# Altium schematic sheet switch matrix.SchDoc
size 584 x 241 mm; SheetNumber: 2; SheetTotal: 2
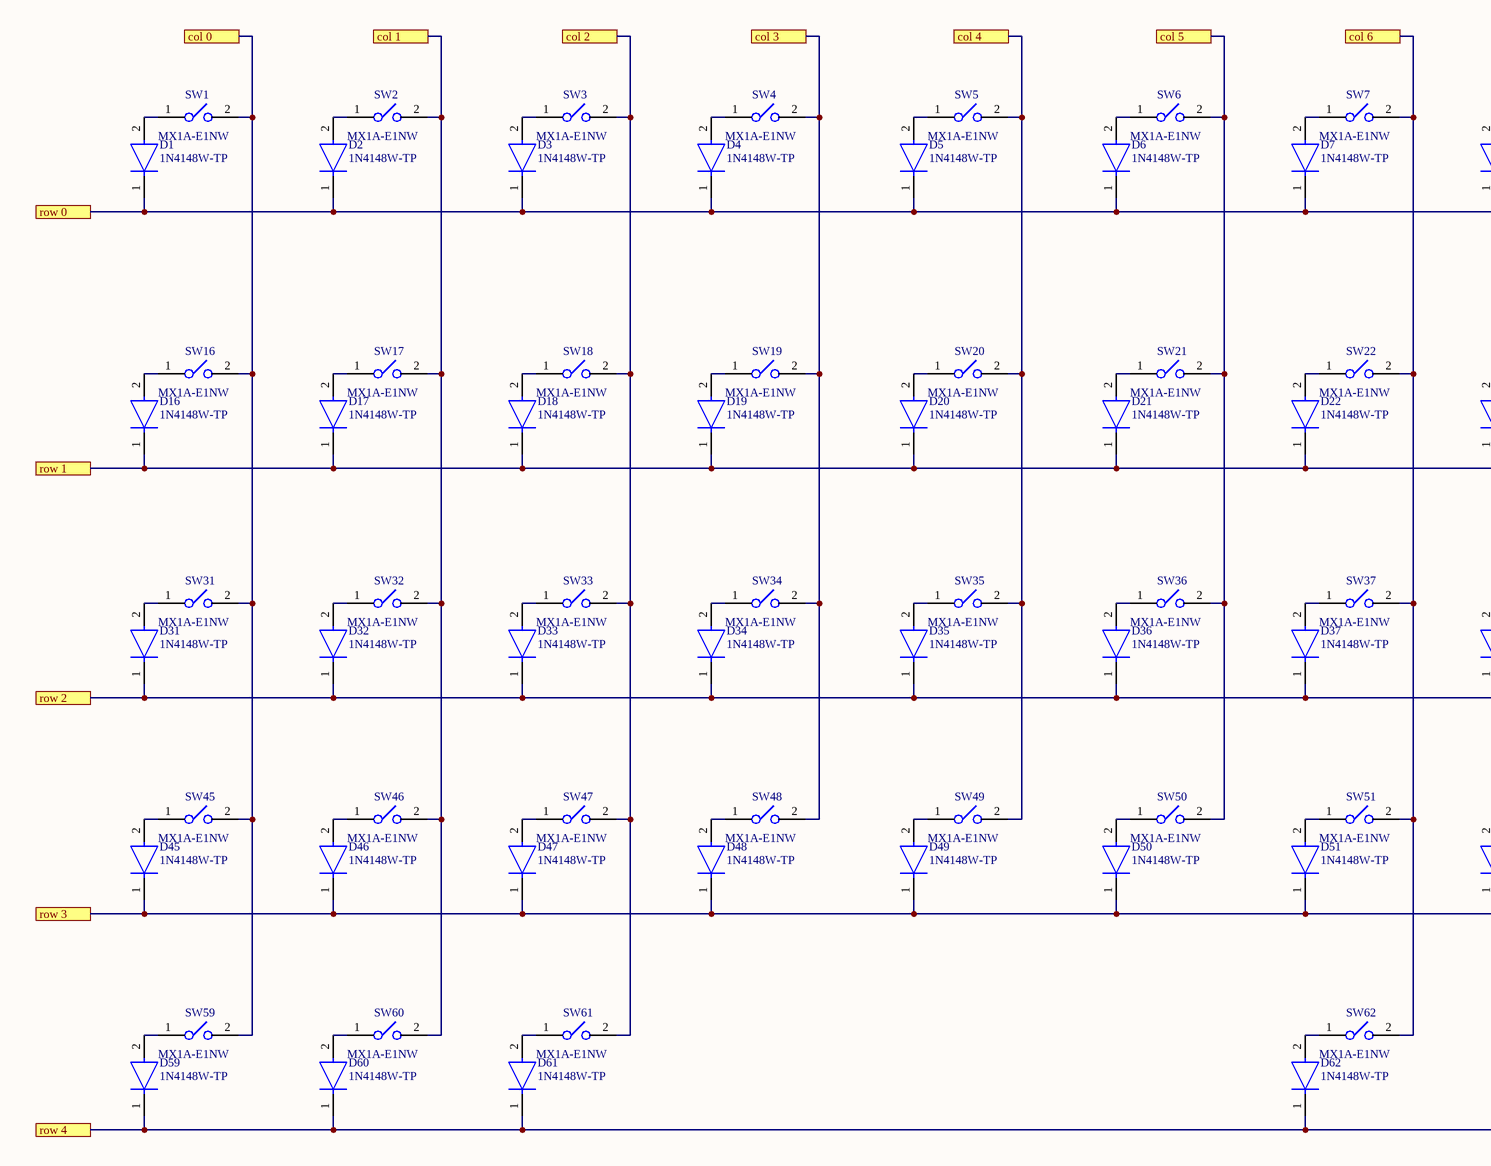
[diagram p0: switch matrix.SchDoc, left]
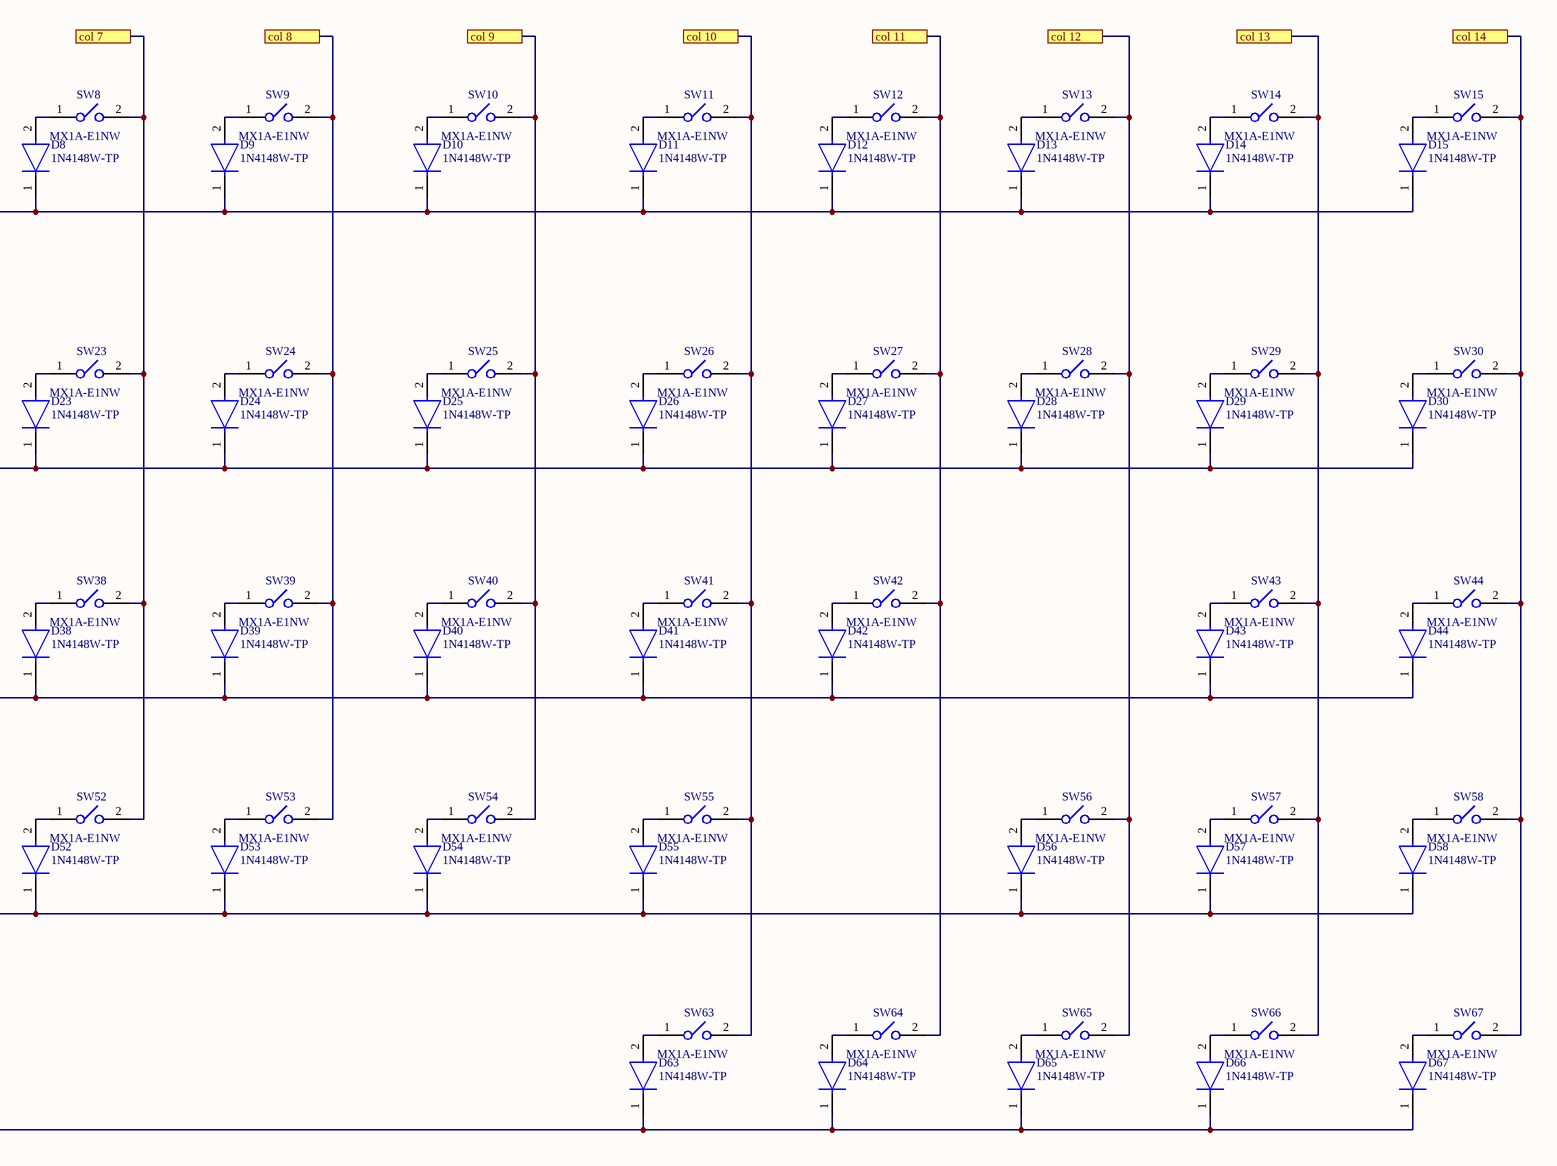
[diagram p1: switch matrix.SchDoc, right]

## Parts
D1  1N4148W-TP  [FP-SOD-123-IPC_A]
D2  1N4148W-TP  [FP-SOD-123-IPC_A]
D3  1N4148W-TP  [FP-SOD-123-IPC_A]
D4  1N4148W-TP  [FP-SOD-123-IPC_A]
D5  1N4148W-TP  [FP-SOD-123-IPC_A]
D6  1N4148W-TP  [FP-SOD-123-IPC_A]
D7  1N4148W-TP  [FP-SOD-123-IPC_A]
D8  1N4148W-TP  [FP-SOD-123-IPC_A]
D9  1N4148W-TP  [FP-SOD-123-IPC_A]
D10  1N4148W-TP  [FP-SOD-123-IPC_A]
D11  1N4148W-TP  [FP-SOD-123-IPC_A]
D12  1N4148W-TP  [FP-SOD-123-IPC_A]
D13  1N4148W-TP  [FP-SOD-123-IPC_A]
D14  1N4148W-TP  [FP-SOD-123-IPC_A]
D15  1N4148W-TP  [FP-SOD-123-IPC_A]
D16  1N4148W-TP  [FP-SOD-123-IPC_A]
D17  1N4148W-TP  [FP-SOD-123-IPC_A]
D18  1N4148W-TP  [FP-SOD-123-IPC_A]
D19  1N4148W-TP  [FP-SOD-123-IPC_A]
D20  1N4148W-TP  [FP-SOD-123-IPC_A]
D21  1N4148W-TP  [FP-SOD-123-IPC_A]
D22  1N4148W-TP  [FP-SOD-123-IPC_A]
D23  1N4148W-TP  [FP-SOD-123-IPC_A]
D24  1N4148W-TP  [FP-SOD-123-IPC_A]
D25  1N4148W-TP  [FP-SOD-123-IPC_A]
D26  1N4148W-TP  [FP-SOD-123-IPC_A]
D27  1N4148W-TP  [FP-SOD-123-IPC_A]
D28  1N4148W-TP  [FP-SOD-123-IPC_A]
D29  1N4148W-TP  [FP-SOD-123-IPC_A]
D30  1N4148W-TP  [FP-SOD-123-IPC_A]
D31  1N4148W-TP  [FP-SOD-123-IPC_A]
D32  1N4148W-TP  [FP-SOD-123-IPC_A]
D33  1N4148W-TP  [FP-SOD-123-IPC_A]
D34  1N4148W-TP  [FP-SOD-123-IPC_A]
D35  1N4148W-TP  [FP-SOD-123-IPC_A]
D36  1N4148W-TP  [FP-SOD-123-IPC_A]
D37  1N4148W-TP  [FP-SOD-123-IPC_A]
D38  1N4148W-TP  [FP-SOD-123-IPC_A]
D39  1N4148W-TP  [FP-SOD-123-IPC_A]
D40  1N4148W-TP  [FP-SOD-123-IPC_A]
D41  1N4148W-TP  [FP-SOD-123-IPC_A]
D42  1N4148W-TP  [FP-SOD-123-IPC_A]
D43  1N4148W-TP  [FP-SOD-123-IPC_A]
D44  1N4148W-TP  [FP-SOD-123-IPC_A]
D45  1N4148W-TP  [FP-SOD-123-IPC_A]
D46  1N4148W-TP  [FP-SOD-123-IPC_A]
D47  1N4148W-TP  [FP-SOD-123-IPC_A]
D48  1N4148W-TP  [FP-SOD-123-IPC_A]
D49  1N4148W-TP  [FP-SOD-123-IPC_A]
D50  1N4148W-TP  [FP-SOD-123-IPC_A]
D51  1N4148W-TP  [FP-SOD-123-IPC_A]
D52  1N4148W-TP  [FP-SOD-123-IPC_A]
D53  1N4148W-TP  [FP-SOD-123-IPC_A]
D54  1N4148W-TP  [FP-SOD-123-IPC_A]
D55  1N4148W-TP  [FP-SOD-123-IPC_A]
D56  1N4148W-TP  [FP-SOD-123-IPC_A]
D57  1N4148W-TP  [FP-SOD-123-IPC_A]
D58  1N4148W-TP  [FP-SOD-123-IPC_A]
D59  1N4148W-TP  [FP-SOD-123-IPC_A]
D60  1N4148W-TP  [FP-SOD-123-IPC_A]
D61  1N4148W-TP  [FP-SOD-123-IPC_A]
D62  1N4148W-TP  [FP-SOD-123-IPC_A]
D63  1N4148W-TP  [FP-SOD-123-IPC_A]
D64  1N4148W-TP  [FP-SOD-123-IPC_A]
D65  1N4148W-TP  [FP-SOD-123-IPC_A]
D66  1N4148W-TP  [FP-SOD-123-IPC_A]
D67  1N4148W-TP  [FP-SOD-123-IPC_A]
SW1  Part Number: MX1A-E1NW  [SW_Cherry_MX_1.00u_PCB]  (hidden comment: Switch_Key_Switch_MX1A-E1NW_eec)
SW2  Part Number: MX1A-E1NW  [SW_Cherry_MX_1.00u_PCB]  (hidden comment: Switch_Key_Switch_MX1A-E1NW_eec)
SW3  Part Number: MX1A-E1NW  [SW_Cherry_MX_1.00u_PCB]  (hidden comment: Switch_Key_Switch_MX1A-E1NW_eec)
SW4  Part Number: MX1A-E1NW  [SW_Cherry_MX_1.00u_PCB]  (hidden comment: Switch_Key_Switch_MX1A-E1NW_eec)
SW5  Part Number: MX1A-E1NW  [SW_Cherry_MX_1.00u_PCB]  (hidden comment: Switch_Key_Switch_MX1A-E1NW_eec)
SW6  Part Number: MX1A-E1NW  [SW_Cherry_MX_1.00u_PCB]  (hidden comment: Switch_Key_Switch_MX1A-E1NW_eec)
SW7  Part Number: MX1A-E1NW  [SW_Cherry_MX_1.00u_PCB]  (hidden comment: Switch_Key_Switch_MX1A-E1NW_eec)
SW8  Part Number: MX1A-E1NW  [SW_Cherry_MX_1.00u_PCB]  (hidden comment: Switch_Key_Switch_MX1A-E1NW_eec)
SW9  Part Number: MX1A-E1NW  [SW_Cherry_MX_1.00u_PCB]  (hidden comment: Switch_Key_Switch_MX1A-E1NW_eec)
SW10  Part Number: MX1A-E1NW  [SW_Cherry_MX_1.00u_PCB]  (hidden comment: Switch_Key_Switch_MX1A-E1NW_eec)
SW11  Part Number: MX1A-E1NW  [SW_Cherry_MX_1.00u_PCB]  (hidden comment: Switch_Key_Switch_MX1A-E1NW_eec)
SW12  Part Number: MX1A-E1NW  [SW_Cherry_MX_1.00u_PCB]  (hidden comment: Switch_Key_Switch_MX1A-E1NW_eec)
SW13  Part Number: MX1A-E1NW  [SW_Cherry_MX_1.00u_PCB]  (hidden comment: Switch_Key_Switch_MX1A-E1NW_eec)
SW14  Part Number: MX1A-E1NW  [SW_Cherry_MX_2.00u_PCB]  (hidden comment: Switch_Key_Switch_MX1A-E1NW_eec)
SW15  Part Number: MX1A-E1NW  [SW_Cherry_MX_1.00u_PCB]  (hidden comment: Switch_Key_Switch_MX1A-E1NW_eec)
SW16  Part Number: MX1A-E1NW  [SW_Cherry_MX_1.50u_PCB]  (hidden comment: Switch_Key_Switch_MX1A-E1NW_eec)
SW17  Part Number: MX1A-E1NW  [SW_Cherry_MX_1.00u_PCB]  (hidden comment: Switch_Key_Switch_MX1A-E1NW_eec)
SW18  Part Number: MX1A-E1NW  [SW_Cherry_MX_1.00u_PCB]  (hidden comment: Switch_Key_Switch_MX1A-E1NW_eec)
SW19  Part Number: MX1A-E1NW  [SW_Cherry_MX_1.00u_PCB]  (hidden comment: Switch_Key_Switch_MX1A-E1NW_eec)
SW20  Part Number: MX1A-E1NW  [SW_Cherry_MX_1.00u_PCB]  (hidden comment: Switch_Key_Switch_MX1A-E1NW_eec)
SW21  Part Number: MX1A-E1NW  [SW_Cherry_MX_1.00u_PCB]  (hidden comment: Switch_Key_Switch_MX1A-E1NW_eec)
SW22  Part Number: MX1A-E1NW  [SW_Cherry_MX_1.00u_PCB]  (hidden comment: Switch_Key_Switch_MX1A-E1NW_eec)
SW23  Part Number: MX1A-E1NW  [SW_Cherry_MX_1.00u_PCB]  (hidden comment: Switch_Key_Switch_MX1A-E1NW_eec)
SW24  Part Number: MX1A-E1NW  [SW_Cherry_MX_1.00u_PCB]  (hidden comment: Switch_Key_Switch_MX1A-E1NW_eec)
SW25  Part Number: MX1A-E1NW  [SW_Cherry_MX_1.00u_PCB]  (hidden comment: Switch_Key_Switch_MX1A-E1NW_eec)
SW26  Part Number: MX1A-E1NW  [SW_Cherry_MX_1.00u_PCB]  (hidden comment: Switch_Key_Switch_MX1A-E1NW_eec)
SW27  Part Number: MX1A-E1NW  [SW_Cherry_MX_1.00u_PCB]  (hidden comment: Switch_Key_Switch_MX1A-E1NW_eec)
SW28  Part Number: MX1A-E1NW  [SW_Cherry_MX_1.00u_PCB]  (hidden comment: Switch_Key_Switch_MX1A-E1NW_eec)
SW29  Part Number: MX1A-E1NW  [SW_Cherry_MX_1.50u_PCB]  (hidden comment: Switch_Key_Switch_MX1A-E1NW_eec)
SW30  Part Number: MX1A-E1NW  [SW_Cherry_MX_1.00u_PCB]  (hidden comment: Switch_Key_Switch_MX1A-E1NW_eec)
SW31  Part Number: MX1A-E1NW  [SW_Cherry_MX_1.75u_PCB]  (hidden comment: Switch_Key_Switch_MX1A-E1NW_eec)
SW32  Part Number: MX1A-E1NW  [SW_Cherry_MX_1.00u_PCB]  (hidden comment: Switch_Key_Switch_MX1A-E1NW_eec)
SW33  Part Number: MX1A-E1NW  [SW_Cherry_MX_1.00u_PCB]  (hidden comment: Switch_Key_Switch_MX1A-E1NW_eec)
SW34  Part Number: MX1A-E1NW  [SW_Cherry_MX_1.00u_PCB]  (hidden comment: Switch_Key_Switch_MX1A-E1NW_eec)
SW35  Part Number: MX1A-E1NW  [SW_Cherry_MX_1.00u_PCB]  (hidden comment: Switch_Key_Switch_MX1A-E1NW_eec)
SW36  Part Number: MX1A-E1NW  [SW_Cherry_MX_1.00u_PCB]  (hidden comment: Switch_Key_Switch_MX1A-E1NW_eec)
SW37  Part Number: MX1A-E1NW  [SW_Cherry_MX_1.00u_PCB]  (hidden comment: Switch_Key_Switch_MX1A-E1NW_eec)
SW38  Part Number: MX1A-E1NW  [SW_Cherry_MX_1.00u_PCB]  (hidden comment: Switch_Key_Switch_MX1A-E1NW_eec)
SW39  Part Number: MX1A-E1NW  [SW_Cherry_MX_1.00u_PCB]  (hidden comment: Switch_Key_Switch_MX1A-E1NW_eec)
SW40  Part Number: MX1A-E1NW  [SW_Cherry_MX_1.00u_PCB]  (hidden comment: Switch_Key_Switch_MX1A-E1NW_eec)
SW41  Part Number: MX1A-E1NW  [SW_Cherry_MX_1.00u_PCB]  (hidden comment: Switch_Key_Switch_MX1A-E1NW_eec)
SW42  Part Number: MX1A-E1NW  [SW_Cherry_MX_1.00u_PCB]  (hidden comment: Switch_Key_Switch_MX1A-E1NW_eec)
SW43  Part Number: MX1A-E1NW  [SW_Cherry_MX_2.00u_PCB]  (hidden comment: Switch_Key_Switch_MX1A-E1NW_eec)
SW44  Part Number: MX1A-E1NW  [SW_Cherry_MX_1.00u_PCB]  (hidden comment: Switch_Key_Switch_MX1A-E1NW_eec)
SW45  Part Number: MX1A-E1NW  [SW_Cherry_MX_2.00u_PCB]  (hidden comment: Switch_Key_Switch_MX1A-E1NW_eec)
SW46  Part Number: MX1A-E1NW  [SW_Cherry_MX_1.00u_PCB]  (hidden comment: Switch_Key_Switch_MX1A-E1NW_eec)
SW47  Part Number: MX1A-E1NW  [SW_Cherry_MX_1.00u_PCB]  (hidden comment: Switch_Key_Switch_MX1A-E1NW_eec)
SW48  Part Number: MX1A-E1NW  [SW_Cherry_MX_1.00u_PCB]  (hidden comment: Switch_Key_Switch_MX1A-E1NW_eec)
SW49  Part Number: MX1A-E1NW  [SW_Cherry_MX_1.00u_PCB]  (hidden comment: Switch_Key_Switch_MX1A-E1NW_eec)
SW50  Part Number: MX1A-E1NW  [SW_Cherry_MX_1.00u_PCB]  (hidden comment: Switch_Key_Switch_MX1A-E1NW_eec)
SW51  Part Number: MX1A-E1NW  [SW_Cherry_MX_1.00u_PCB]  (hidden comment: Switch_Key_Switch_MX1A-E1NW_eec)
SW52  Part Number: MX1A-E1NW  [SW_Cherry_MX_1.00u_PCB]  (hidden comment: Switch_Key_Switch_MX1A-E1NW_eec)
SW53  Part Number: MX1A-E1NW  [SW_Cherry_MX_1.00u_PCB]  (hidden comment: Switch_Key_Switch_MX1A-E1NW_eec)
SW54  Part Number: MX1A-E1NW  [SW_Cherry_MX_1.00u_PCB]  (hidden comment: Switch_Key_Switch_MX1A-E1NW_eec)
SW55  Part Number: MX1A-E1NW  [SW_Cherry_MX_1.00u_PCB]  (hidden comment: Switch_Key_Switch_MX1A-E1NW_eec)
SW56  Part Number: MX1A-E1NW  [SW_Cherry_MX_1.75u_PCB]  (hidden comment: Switch_Key_Switch_MX1A-E1NW_eec)
SW57  Part Number: MX1A-E1NW  [SW_Cherry_MX_1.00u_PCB]  (hidden comment: Switch_Key_Switch_MX1A-E1NW_eec)
SW58  Part Number: MX1A-E1NW  [SW_Cherry_MX_1.00u_PCB]  (hidden comment: Switch_Key_Switch_MX1A-E1NW_eec)
SW59  Part Number: MX1A-E1NW  [SW_Cherry_MX_1.50u_PCB]  (hidden comment: Switch_Key_Switch_MX1A-E1NW_eec)
SW60  Part Number: MX1A-E1NW  [SW_Cherry_MX_1.25u_PCB]  (hidden comment: Switch_Key_Switch_MX1A-E1NW_eec)
SW61  Part Number: MX1A-E1NW  [SW_Cherry_MX_1.50u_PCB]  (hidden comment: Switch_Key_Switch_MX1A-E1NW_eec)
SW62  Part Number: MX1A-E1NW  [SW_Cherry_MX_6.25u_PCB]  (hidden comment: Switch_Key_Switch_MX1A-E1NW_eec)
SW63  Part Number: MX1A-E1NW  [SW_Cherry_MX_1.25u_PCB]  (hidden comment: Switch_Key_Switch_MX1A-E1NW_eec)
SW64  Part Number: MX1A-E1NW  [SW_Cherry_MX_1.00u_PCB]  (hidden comment: Switch_Key_Switch_MX1A-E1NW_eec)
SW65  Part Number: MX1A-E1NW  [SW_Cherry_MX_1.00u_PCB]  (hidden comment: Switch_Key_Switch_MX1A-E1NW_eec)
SW66  Part Number: MX1A-E1NW  [SW_Cherry_MX_1.00u_PCB]  (hidden comment: Switch_Key_Switch_MX1A-E1NW_eec)
SW67  Part Number: MX1A-E1NW  [SW_Cherry_MX_1.00u_PCB]  (hidden comment: Switch_Key_Switch_MX1A-E1NW_eec)

## Ports
col 0, col 1, col 2, col 3, col 4, col 5, col 6, col 7, col 8, col 9, col 10, col 11, col 12, col 13, col 14, row 0, row 1, row 2, row 3, row 4

## Nets
col 0: SW1.2 SW16.2 SW31.2 SW45.2 SW59.2 ; port col 0
col 1: SW2.2 SW17.2 SW32.2 SW46.2 SW60.2 ; port col 1
col 2: SW3.2 SW18.2 SW33.2 SW47.2 SW61.2 ; port col 2
col 3: SW4.2 SW19.2 SW34.2 SW48.2 ; port col 3
col 4: SW5.2 SW20.2 SW35.2 SW49.2 ; port col 4
col 5: SW6.2 SW21.2 SW36.2 SW50.2 ; port col 5
col 6: SW7.2 SW22.2 SW37.2 SW51.2 SW62.2 ; port col 6
col 7: SW8.2 SW23.2 SW38.2 SW52.2 ; port col 7
col 8: SW9.2 SW24.2 SW39.2 SW53.2 ; port col 8
col 9: SW10.2 SW25.2 SW40.2 SW54.2 ; port col 9
col 10: SW11.2 SW26.2 SW41.2 SW55.2 SW63.2 ; port col 10
col 11: SW12.2 SW27.2 SW42.2 SW64.2 ; port col 11
col 12: SW13.2 SW28.2 SW56.2 SW65.2 ; port col 12
col 13: SW14.2 SW29.2 SW43.2 SW57.2 SW66.2 ; port col 13
col 14: SW15.2 SW30.2 SW44.2 SW58.2 SW67.2 ; port col 14
row 0: D1.1(C) D2.1(C) D3.1(C) D4.1(C) D5.1(C) D6.1(C) D7.1(C) D8.1(C) D9.1(C) D10.1(C) D11.1(C) D12.1(C) D13.1(C) D14.1(C) D15.1(C) ; port row 0
row 1: D16.1(C) D17.1(C) D18.1(C) D19.1(C) D20.1(C) D21.1(C) D22.1(C) D23.1(C) D24.1(C) D25.1(C) D26.1(C) D27.1(C) D28.1(C) D29.1(C) D30.1(C) ; port row 1
row 2: D31.1(C) D32.1(C) D33.1(C) D34.1(C) D35.1(C) D36.1(C) D37.1(C) D38.1(C) D39.1(C) D40.1(C) D41.1(C) D42.1(C) D43.1(C) D44.1(C) ; port row 2
row 3: D45.1(C) D46.1(C) D47.1(C) D48.1(C) D49.1(C) D50.1(C) D51.1(C) D52.1(C) D53.1(C) D54.1(C) D55.1(C) D56.1(C) D57.1(C) D58.1(C) ; port row 3
row 4: D59.1(C) D60.1(C) D61.1(C) D62.1(C) D63.1(C) D64.1(C) D65.1(C) D66.1(C) D67.1(C) ; port row 4
NetD1_2: D1.2(A) SW1.1
NetD2_2: D2.2(A) SW2.1
NetD3_2: D3.2(A) SW3.1
NetD4_2: D4.2(A) SW4.1
NetD5_2: D5.2(A) SW5.1
NetD6_2: D6.2(A) SW6.1
NetD7_2: D7.2(A) SW7.1
NetD8_2: D8.2(A) SW8.1
NetD9_2: D9.2(A) SW9.1
NetD10_2: D10.2(A) SW10.1
NetD11_2: D11.2(A) SW11.1
NetD12_2: D12.2(A) SW12.1
NetD13_2: D13.2(A) SW13.1
NetD14_2: D14.2(A) SW14.1
NetD15_2: D15.2(A) SW15.1
NetD16_2: D16.2(A) SW16.1
NetD17_2: D17.2(A) SW17.1
NetD18_2: D18.2(A) SW18.1
NetD19_2: D19.2(A) SW19.1
NetD20_2: D20.2(A) SW20.1
NetD21_2: D21.2(A) SW21.1
NetD22_2: D22.2(A) SW22.1
NetD23_2: D23.2(A) SW23.1
NetD24_2: D24.2(A) SW24.1
NetD25_2: D25.2(A) SW25.1
NetD26_2: D26.2(A) SW26.1
NetD27_2: D27.2(A) SW27.1
NetD28_2: D28.2(A) SW28.1
NetD29_2: D29.2(A) SW29.1
NetD30_2: D30.2(A) SW30.1
NetD31_2: D31.2(A) SW31.1
NetD32_2: D32.2(A) SW32.1
NetD33_2: D33.2(A) SW33.1
NetD34_2: D34.2(A) SW34.1
NetD35_2: D35.2(A) SW35.1
NetD36_2: D36.2(A) SW36.1
NetD37_2: D37.2(A) SW37.1
NetD38_2: D38.2(A) SW38.1
NetD39_2: D39.2(A) SW39.1
NetD40_2: D40.2(A) SW40.1
NetD41_2: D41.2(A) SW41.1
NetD42_2: D42.2(A) SW42.1
NetD43_2: D43.2(A) SW43.1
NetD44_2: D44.2(A) SW44.1
NetD45_2: D45.2(A) SW45.1
NetD46_2: D46.2(A) SW46.1
NetD47_2: D47.2(A) SW47.1
NetD48_2: D48.2(A) SW48.1
NetD49_2: D49.2(A) SW49.1
NetD50_2: D50.2(A) SW50.1
NetD51_2: D51.2(A) SW51.1
NetD52_2: D52.2(A) SW52.1
NetD53_2: D53.2(A) SW53.1
NetD54_2: D54.2(A) SW54.1
NetD55_2: D55.2(A) SW55.1
NetD56_2: D56.2(A) SW56.1
NetD57_2: D57.2(A) SW57.1
NetD58_2: D58.2(A) SW58.1
NetD59_2: D59.2(A) SW59.1
NetD60_2: D60.2(A) SW60.1
NetD61_2: D61.2(A) SW61.1
NetD62_2: D62.2(A) SW62.1
NetD63_2: D63.2(A) SW63.1
NetD64_2: D64.2(A) SW64.1
NetD65_2: D65.2(A) SW65.1
NetD66_2: D66.2(A) SW66.1
NetD67_2: D67.2(A) SW67.1

## Library data of the parts
D1-D67 = CMP-2000-04993-2: DIODE GEN PURP 100V 150MA SOD123; Max Reverse Leakage Current: 5uA; Max Surge Current: 2A; Reverse Recovery Time: 4ns; Polarity: Standard; Capacitance: 4pF; Max Forward Surge Current (Ifsm): 1A; Element Configuration: Single; Power Dissipation: 400mW; Forward Voltage: 1V; Radiation Hardening: No; Lead Free: Lead Free; Max Reverse Voltage (DC): 100V; Current Rating: 150mA; Forward Current: 150mA; Packaging: Tape and Reel; Number of Pins: 2; Package Quantity: 3000; Max Operating Temperature: 150°C; Min Operating Temperature: -65°C; Average Rectified Current: 150mA; Recovery Time: 4ns; Output Current: 150mA; Peak Non-Repetitive Surge Current: 2A; Width: 1.8mm; Voltage Rating (DC): 100V; Height: 1.2mm; Max Repetitive Reverse Voltage (Vrrm): 100V; Mount: Surface Mount; Length: 2.85mm
SW1-SW67 = Switch_Key_Switch_MX1A-E1NW_eec: SWITCH PUSH SPST-NO 0.01A 12V; Manufacturer: Key Switch; Category 8Ce341E9Bf4C5724: Switches; size_length: 15.6 mm; contact_current_rating: 10 mA; Category Db391633E8F300Fe: Industrial Control; Category 6A0Ba70159B8B1Cc: Keylock; contact_plating: Gold; Category A9A064Aa9A0A7267: Tactile / Jog; contacts_type: SPST; Category 2Bfae6F01857F03D: Pushbutton; Num Pins: 2; Category 6E88A3825D3Cb54F: Uncategorized; helpURL: https://upverter.com/upn/revision/8244d7a80b28a9e1/; ComponentLink2Description: Datasheet; Temperature: -10°C to +70°C; Package: MX1A; Supplier 2: Mouser; Price: 0.741007758432; Supplier 1: Digi-Key; ComponentLink1URL: https://upverter.com/upn/revision/8244d7a80b28a9e1/; Supplier Part Number 2: 540-MX1A-E1NW; Supplier Part Number 1: CH197-ND; Voltage: 12V; ComponentLink1Description: Upverter; ComponentLink2URL: https://upverter.com/datasheet/a174b925b05052267a652262a41f429ea7a87855.pdf; RoHS: TRUE; Mouser Part Number: 540-MX1A-E1NW; orientation: Vertical; Temperature Range High: +70°C; Digikey Description: SWITCH PUSH SPST-NO 0.01A 12V; Digikey Part Number: CH197-ND; Lead Free: yes; Temperature Range Low: -10°C; Mounting Type: lug; size_width: 15.6 mm